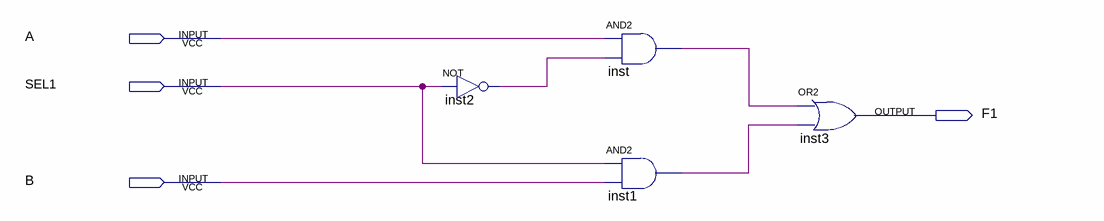
[diagram p0: schematic sheet]
// Quartus schematic MUX2_1.bdf as structural Verilog: 4 symbols, 4 pins
module MUX2_1 (
  input  A,
  input  SEL1,
  input  B,
  output F1
);

  wire inst1_out, inst2_out, inst_out;

  not inst2 (inst2_out, SEL1);
  and inst (inst_out, A, inst2_out);
  and inst1 (inst1_out, SEL1, B);
  or inst3 (F1, inst_out, inst1_out);
endmodule
